# Altium schematic sheet P1.Power Supplies.SchDoc
size A
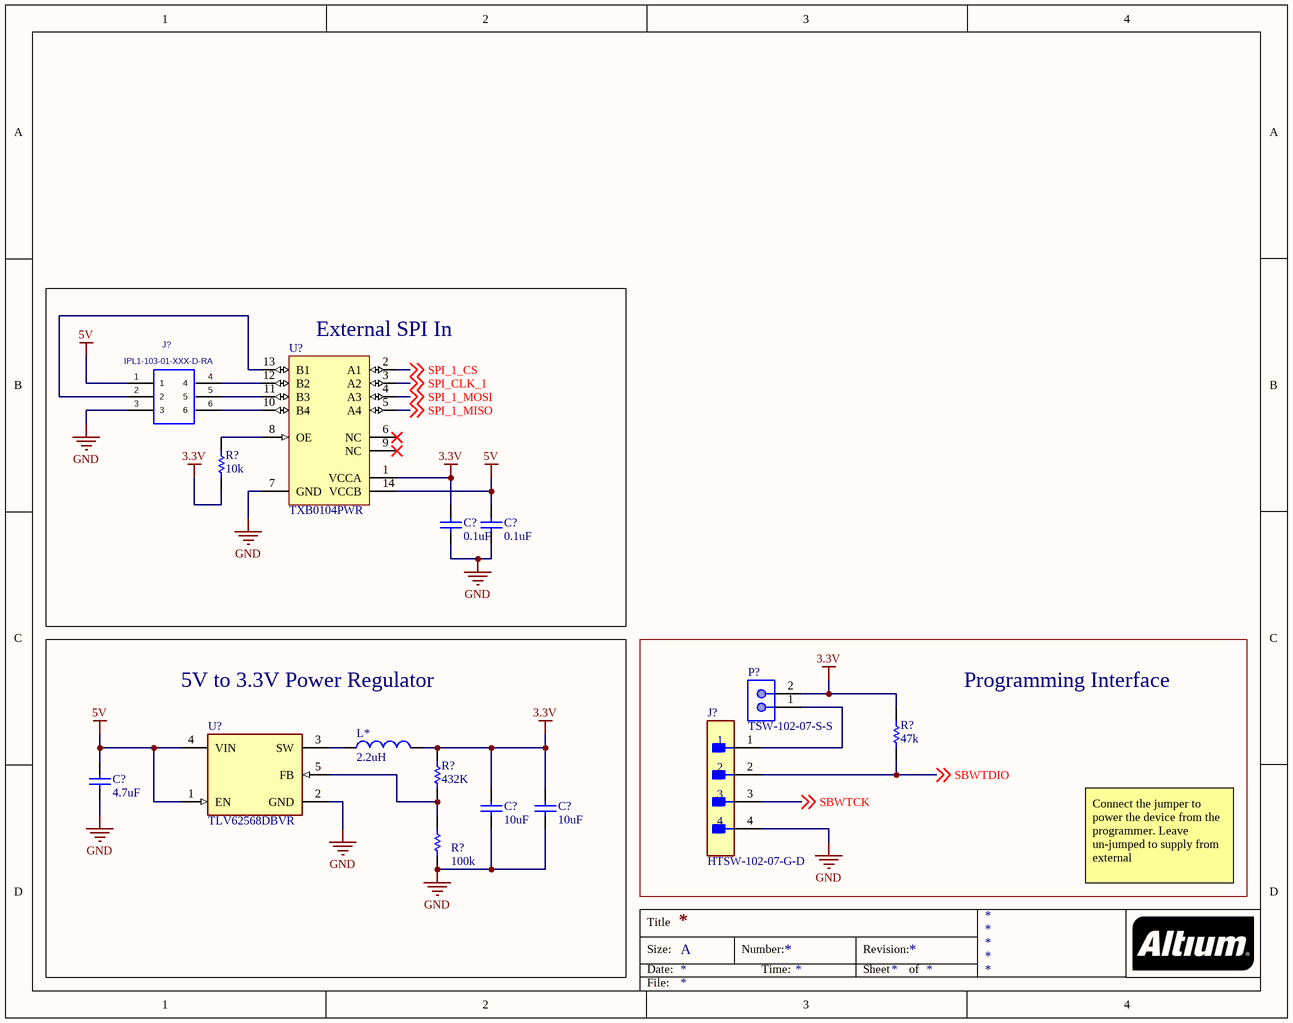
[diagram p0: P1.Power Supplies.SchDoc]

## Parts
(Parts that share a designator on the sheet are numbered #1, #2 ... from top to bottom, then left to right.)
C?#1  0.1uF  [CAPC1608X05L]
C?#2  0.1uF  [CAPC1608X05L]
C?#3  4.7uF  [CAPC2113X15N]
C?#4  10uF  [CAPC1608X05L]
C?#5  10uF  [CAPC1608X05L]
J?#1  IPL1-103-01-XXX-D-RA  [IPL1-103-01-XXX-D-RA]
J?#2  HTSW-102-07-G-D  [FP-HTSW-102-07-G-D-MFG]
L*  2.2uH  [INDC2521X10L]
P?  TSW-102-07-S-S  [SMTC-TSW-102-07-S-S]
R?#1  10k  [CAPC1608X05L]
R?#2  47k  [RESC2013X50X30ML20T20]
R?#3  432K  [RESC2013X60X40LL20T25]
R?#4  100k  [RESC2013X50X30LL20T20]
U?#1  TXB0104PWR  [PW0014A_L]
U?#2  TLV62568DBVR  [FP-DBV0005A-MFG]

## Blocks framed on the sheet
External SPI In: C?#1 C?#2 J?#1 R?#1 U?#1
5V to 3.3V Power Regulator: C?#3-C?#5 L* R?#3 R?#4 U?#2
Programming Interface: J?#2 P? R?#2

## Nets
3.3V: C?#1.2 C?#4.2 C?#5.2 L*.2 P?.2 R?#1.1 R?#2.2 R?#3.2 U?#1.1(VCCA)
5V: C?#2.2 C?#3.2 J?#1.1 U?#1.14(VCCB) U?#2.1(EN) U?#2.4(VIN)
GND: C?#1.1 C?#2.1 C?#3.1 C?#4.1 C?#5.1 J?#1.3 J?#2.4 R?#4.1 U?#1.7(GND) U?#2.2(GND)
SBWTCK: J?#2.3 ; off-sheet SBWTCK
SBWTDIO: J?#2.2 R?#2.1 ; off-sheet SBWTDIO
SPI_1_CS: U?#1.2(A1) ; off-sheet SPI_1_CS
SPI_1_MISO: U?#1.5(A4) ; off-sheet SPI_1_MISO
SPI_1_MOSI: U?#1.4(A3) ; off-sheet SPI_1_MOSI
SPI_CLK_1: U?#1.3(A2) ; off-sheet SPI_CLK_1
NetJ?#1_2: J?#1.2 U?#1.13(B1)
NetJ?#1_4: J?#1.4 U?#1.12(B2)
NetJ?#1_5: J?#1.5 U?#1.11(B3)
NetJ?#1_6: J?#1.6 U?#1.10(B4)
NetJ?#2_1: J?#2.1 P?.1
NetL*_1: L*.1 U?#2.3(SW)
NetR?#1_2: R?#1.2 U?#1.8(OE)
NetR?#3_1: R?#3.1 R?#4.2 U?#2.5(FB)

Not connected (* = marked no-connect by the designer): U?#1 6(NC)* 9(NC)*

## Notes on the sheet
- Connect the jumper to power the device from the programmer. Leave un-jumped to supply from external
- Title
- Size:
- Date:
- A
- Number:
- Time:
- Revision:
- Sheet
- of
- File:

## Library data of the parts
C?#1 C?#2 = HMK107B7104KAHT: CAP ,MIDHIGH VOL,0603,100V,X7R,0.1UF 10% ,T&R; Manufacturer 1: Taiyo Yuden; Capacitance: 100nF; Supplier 1: Digi-Key; Manufacturer Part Number 1: HMK107B7104KAHT; Stock 1: 3336; Pricing 1: 1=0.21000, 10=0.14900, 100=0.06990, 500=0.04898, 1000=0.04055 (USD); RoHS: Yes; Mount: Surface Mount; Case/Package: 0603; Min Operating Temperature: -55°C; Max Operating Temperature: 125°C; Packaging: Tape and Reel; Voltage Rating: 100V; Tolerance: 10%; Length: 0.063inch; Width: 0.031inch; Thickness: 0.035inch; Ratings: AEC-Q200; ComponentLink1URL: http://ds.yuden.co.jp/TYCOMPAS/ut/detail.do?productNo=HMK107B7104KAHT&fileName=HMK107B7104KAHT_SS&mode=specSheetDownload&src-supplier=Digi-Key; ComponentLink1Description: http://ds.yuden.co.jp/TYCOMPAS/ut/detail.do?productNo=HMK107B7104KAHT&fileName=HMK107B7104KAHT_SS&mode=specSheetDownload&src-supplier=Digi-Key; ComponentLink2URL: http://www.yuden.co.jp/productdata/catalog/en/mlcc06_hq_e.pdf?src-supplier=Digi-Key; ComponentLink2Description: http://www.yuden.co.jp/productdata/catalog/en/mlcc06_hq_e.pdf?src-supplier=Digi-Key; ComponentLink3URL: https://ds.yuden.co.jp/TYCOMPAS/ut/detail?pn=HMK107B7104KAHT &amp;u=M&src-supplier=Digi-Key; ComponentLink3Description: https://ds.yuden.co.jp/TYCOMPAS/ut/detail?pn=HMK107B7104KAHT &amp;u=M&src-supplier=Digi-Key
C?#3 = C2012X7R1V475K125AE: CAP CER 4.7UF 35V X7R 0805; Manufacturer 1: TDK; Tolerance: 10%; Supplier 1: Digi-Key; Manufacturer Part Number 1: C2012X7R1V475K125AE; Stock 1: 34290; Pricing 1: 1=0.67000, 10=0.47200, 100=0.31050, 500=0.23000, 1000=0.19550 (USD); RoHS: Yes; Mount: Surface Mount; Case/Package: 0805; Weight: 0.000194oz; Case Code (Metric): 2012; Case Code (Imperial): 0805; Min Operating Temperature: -55°C; Max Operating Temperature: 125°C; Capacitance: 4.7uF; Packaging: Tape and Reel; Voltage Rating: 35V; Dielectric: X7R; Termination: SMD/SMT; Voltage Rating (DC): 35V; Package Quantity: 2000; Features: Soft Termination; Length: 0.079inch; Height: 1.25mm; Width: 1.2mm; Thickness: 0.059inch; Lead Free: Lead Free; ComponentLink1URL: http://www.mouser.com/ds/2/400/tdk_mlcc_commercial_general_en-542463.pdf?src-supplier=Mouser; ComponentLink1Description: http://www.mouser.com/ds/2/400/tdk_mlcc_commercial_general_en-542463.pdf?src-supplier=Mouser; ComponentLink2URL: https://product.tdk.com/info/en/catalog/datasheets/mlcc_commercial_soft_en.pdf?src-supplier=Digi-Key; ComponentLink2Description: https://product.tdk.com/info/en/catalog/datasheets/mlcc_commercial_soft_en.pdf?src-supplier=Digi-Key; ComponentLink3URL: https://product.tdk.com/info/en/catalog/spec/mlccspec_commercial_soft_en.pdf?src-supplier=Digi-Key; ComponentLink3Description: https://product.tdk.com/info/en/catalog/spec/mlccspec_commercial_soft_en.pdf?src-supplier=Digi-Key
C?#4 C?#5 = CL10A106MQ8NNNC: Cap Ceramic 10uF 6.3V X5R 20% SMD 0603 85C Paper T/R; Manufacturer: Samsung; Supplier 1: Digi-Key; Manufacturer Part Number: CL10A106MQ8NNNC; Stock 1: 40000; Pricing 1: 1=0.15, 10=0.11, 100=0.0515, 500=0.03614, 1000=0.02992 (USD); Mount: Surface Mount; Case/Package: 0603; Case Code (Metric): 1608; Case Code (Imperial): 0603; Contact Plating: Tin; Min Operating Temperature: -55°C; Max Operating Temperature: 85°C; Capacitance: 10uF; Tolerance: 20%; Dielectric: X5R; Package Quantity: 1; Packaging: Tape and Reel; Voltage Rating: 6.3V; Voltage: 6.3V; Length: 1.6mm; Height: 0.8mm; Width: 0.031inch; Thickness: 0.035inch; Depth: 0.8mm; Radiation Hardening: No; ComponentLink1URL: http://www.samsungsem.com/kr/support/library/product-catalog/mlcc.jsp; ComponentLink1Description: http://www.samsungsem.com/kr/support/library/product-catalog/mlcc.jsp; ComponentLink2URL: https://www.verical.com/server-webapp/html/getDatasheet?partID=357557; ComponentLink2Description: https://www.verical.com/server-webapp/html/getDatasheet?partID=357557; ComponentLink3URL: http://www1.futureelectronics.com/doc/SAMSUNG%20PASSIVE/CL05B104KQ5NNNC.pdf; ComponentLink3Description: http://www1.futureelectronics.com/doc/SAMSUNG%20PASSIVE/CL05B104KQ5NNNC.pdf
J?#1 = IPL1-103-01-XXX-D-RA: Terminal Assembly, Double Row, Right Angle, Thru-Hole, 0.100" x 0.100" Pitch, 6Pins; MANUFACTURER: SAMTEC; CREATED: July 16, 2014 - Wendy Xin; PCB DECAL: IPL1-103-01-XXX-D-RA
J?#2 = CMP-02766-000010-1: CONN HEADER VERT 4POS 2.54MM; Manufacturer: Samtec; Voltage Rating: 550V; Conn Orientation: Straight; Number Of Contacts: 4; Description: Connector Header Through Hole 4 position 0.100" (2.54mm); Conn Gender: Male; Current Rating: 6.3A; Number Of Rows: 2; Category: Conn; Temperature: -55°C to +125°C; Automotive: No; Digikey Description: CONN HEADER VERT 4POS 2.54MM; ComponentLink2URL: http://suddendocs.samtec.com/catalog_english/htsw_th.pdf; Device Class L2: Headers and Wire Housings; Mouser Description: Conn Unshrouded Header HDR 4 POS 2.54mm Solder ST Thru-Hole Bag; Manufacturer Part Number: HTSW-102-07-G-D; Temperature Range High: +125°C; Contact Material: Gold,Nickel; Temperature Range Low: -55°C; ComponentLink2Description: Datasheet; Device Class L1: Connectors; Pitch: 2.54mm; Octopart: https://octopart.com/htsw-102-07-g-d-samtec-10531767; RoHS: TRUE; Package: HTSW-102-07-G-D; Lead Free: Yes; Device Class L3: unset; Height: 8.71mm
L* = ASMPH-1008-2R2M-T: FIXED IND 2.2UH 1.3A 80 MOHM SMD; Manufacturer: Abracon; Core Material: Ferrite; Self Resonant Frequency: 55MHz; Shielding: Shielded; Tolerance: 20%; Saturation Current: 850mA; DC Resistance (DCR): 80mR; Test Frequency: 1MHz; Supplier 1: Digi-Key; Manufacturer Part Number: ASMPH-1008-2R2M-T; Stock 1: 8992; Pricing 1: 1=0.39, 10=0.345, 100=0.2372, 500=0.20268, 1000=0.15525 (USD); Mount: Surface Mount; Case/Package: 1008; Case Code (Metric): 2520; Case Code (Imperial): 1008; Min Operating Temperature: -40°C; Max Operating Temperature: 85°C; Packaging: Tape and Reel; Package Quantity: 3000; Current Rating: 1.3A; Inductance: 2.2uh; Max DC Current: 850mA; Termination: SMD/SMT; Length: 0.098inch; Height: 0.9mm; Width: 2mm; Height - Seated (Max): 0.039inch; ComponentLink1URL: http://www.abracon.com/Magnetics/power/ASMPH-1008.pdf; ComponentLink1Description: http://www.abracon.com/Magnetics/power/ASMPH-1008.pdf
P? = CMP-1681-00004-4: Male Header, Pitch 2.54 mm, 1 x 2 Position, Height 8.38 mm, Tail Length 2.54 mm, -55 to 125 degC, RoHS, Bulk; Manufacturer: Samtec; Rows: 1; ComponentLink1URL: http://www.samtec.com/; Contact Finish: Gold; Mounting Technology: Through Hole; PackageReference: TSW-102-07-S-S; RoHSCompliant: true; Pins: 2; Contact Material: Bronze; ComponentLink2Description: Datasheet; Max Operating Temperature: 125 degC; Min Operating Temperature: -55 degC; Height: 8.38 mm; Packaging: Bulk; ComponentLink1Description: Manufacturer URL; PackageDescription: Male Header, Pitch 2.54 mm, 1 x 2 Position, Height 8.38 mm, Tail Length 2.54 mm; Colour: Black; Contact Plating: Gold; Length: 5.08 mm; ComponentLink2URL: http://suddendocs.samtec.com/catalog_english/tsw_th.pdf; DatasheetVersion: 12/2015; Mount: Through Hole; Lead Pitch: 0.1 inch; REACH SVHC: No SVHC; Package Quantity: 1
R?#1 = RR0816P-103-D: RES SMD 10K OHM 0.5% 1/16W 0816; Manufacturer: Susumu; Resistance: 10kR; Power Rating: 63mW; Voltage Rating: 75V; Temperature Coefficient: 25ppm/°C; Supplier 1: Digi-Key; Manufacturer Part Number: RR0816P-103-D; Stock 1: 1031099; Pricing 1: 1=0.11, 10=0.098, 100=0.0376, 1000=0.01654, 2500=0.01428 (USD); Case/Package: 0603; Number of Pins: 2; Weight: 7.1E-05oz; Case Code (Imperial): 0603; Case Code (Metric): 1608; Min Operating Temperature: -55°C; Max Operating Temperature: 125°C; Packaging: Tape and Reel; Tolerance: 0.5%; Package Quantity: 1; Termination: SMD/SMT; Composition: Thin Film; Number of Terminations: 2; Max Power Dissipation: 63mW; Voltage Rating (DC): 75V; Length: 1.6mm; Height: 0.4mm; Width: 0.8mm; Depth: 0.8mm; REACH SVHC: Unknown; Lead Free: Lead Free; ComponentLink1URL: http://documents.rs-components.com/techlib://itc_doclist_GB.htm?stockno=3915321; ComponentLink1Description: http://documents.rs-components.com/techlib://itc_doclist_GB.htm?stockno=3915321; ComponentLink2URL: http://www.susumu.co.jp/common/pdf/n_catalog_partition05_en.pdf; ComponentLink2Description: http://www.susumu.co.jp/common/pdf/n_catalog_partition05_en.pdf
R?#2 = CMP-2001-03939-1: Part Number: CRCW080547K0FKEA; Manufacturer: Vishay Dale
R?#3 = CMP-2001-00826-1: Part Number: ERA6AEB4323V; Manufacturer: Panasonic
R?#4 = CMP-2001-04899-1: 100k resistor 1% 0805; Part Number: CRCW0805100KFKEA; Manufacturer: Vishay Dale
U?#1 = CMP-2000-07335-1: 4-Bit Bidirectional Voltage-Level Translator with Automatic Direction Sensing and +/- 15-kV ESD Protection, -40 to 85 degC, 14-Pin TSSOP (PW), Green (RoHS & Sb/Br), Tape and Reel; Manufacturer: Texas Instruments; Dynamic Catalog: TXBSeries; Number of Bits: 4; Voltage - Supply: 1.2V~3.6V,1.65V~5.5V; Other Names: 296-21929-6; Propagation Delay (Max): 4ns; Logic Function: Translator,Bidirectional; Data Rate: 100Mbps; Differential - Input: Output:No/No; Number of Outputs/Channel: 1; Output Type: Logic; Product Training Modules: VoltageLevelTranslation; Number of Channels: 4; Package Reference: PW14; Package Description: 14-Pin Thin Shrink Small Outline Package, Body 5 x 4.4 mm, Pitch 0.65 mm; Datasheet Version: Rev. G, 11/2014; Manufacturer URL: http://www.ti.com/; Series: -; Packaging: Digi-Reel®; Mounting Technology: SurfaceMount; Family: Logic-Translators; Standard Package: 1; Category: IntegratedCircuits(ICs); Supplier Device Package: 14-TSSOP; Datasheet URL: http://www.ti.com/general/docs/lit/getliterature.tsp?genericPartNumber=TXB0104&fileType=pdf; Operating Temperature: -40°C~85°C; Input Type: Logic; Package / Case: 14-TSSOP(0.173",4.40mmWidth)
U?#2 = CMP-04918-000009-1: IC REG BUCK ADJ 1A SOT23-5; Manufacturer: Texas Instruments; Number Of Outputs: 1; Max Supply Voltage: 5.5V; Nominal Supply Current: 35uA; Standoff Height: 0mm; Max Junction Temp: +125°C; Output Voltage: 0.6-5.5V; Max Duty Cycle: 100%; Output Type: AdjustableProgrammable; Min Supply Voltage: 2.5V; Switching Frequency: 1.5MHz; Height: 1.45mm; Mouser Description: 1-A High Efficiency Synchronous Buck Converter, SMD, 5-pin SOT-23, T/R 3k; Temperature Range High: +125°C; Manufacturer Part Number: TLV62568DBVR; Switching Topology: Buck; ComponentLink2Description: Datasheet; Digikey Description: IC REG BUCK ADJ 1A SOT23-5; Octopart: https://octopart.com/tlv62568dbvr-texas+instruments-76926199; Category: IC; Device Class L1: Integrated Circuits (ICs); RoHS: TRUE; ComponentLink2URL: http://www.ti.com/lit/ds/symlink/tlv62568.pdf; Lead Free: Yes; Package: DBV0005A; Automotive: No; Device Class L2: Power Management ICs; Temperature: -40°C to +125°C; Temperature Range Low: -40°C; Device Class L3: Voltage Regulators - Switching; Output Current: 1A